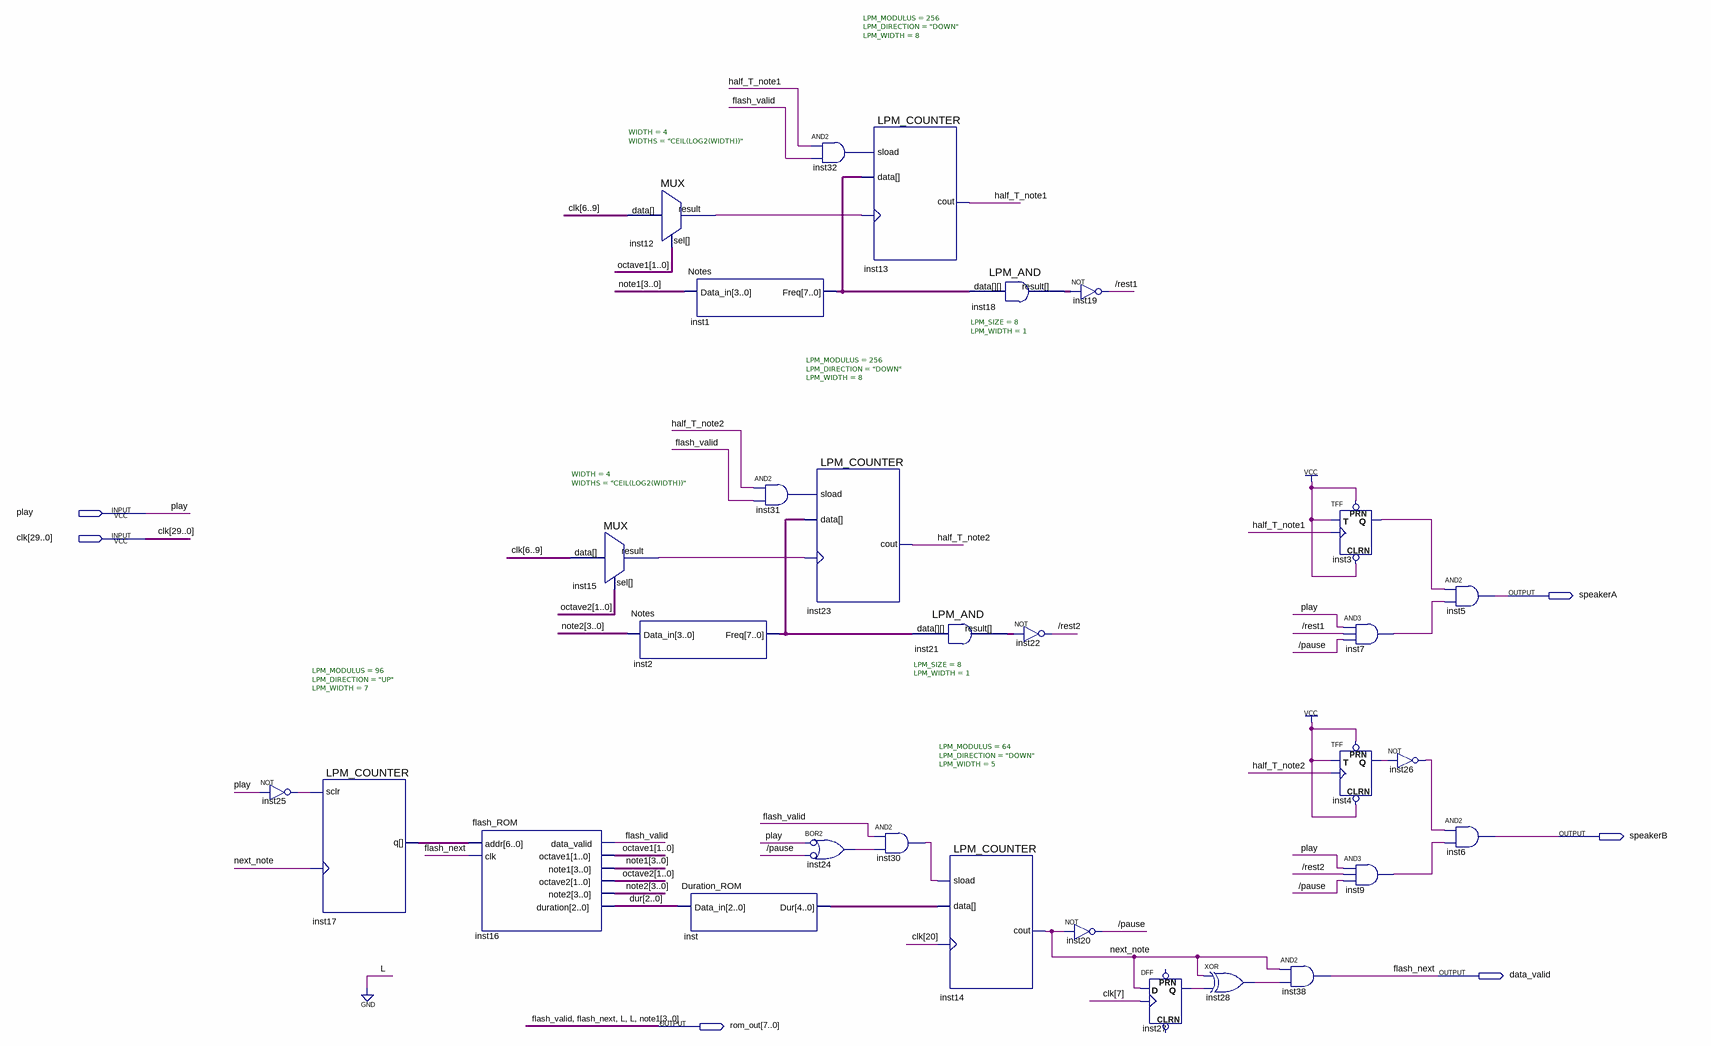
[diagram p0: schematic sheet]
// Quartus schematic Music_Player.bdf as structural Verilog: 30 symbols, 6 pins
module Music_Player (
  input  play,
  input  [29:0] clk,
  output speakerA,
  output speakerB,
  output data_valid,
  output [7:0] rom_out
);

  wire \/pause , \/rest1 , \/rest2 , half_T_note1, half_T_note2, inst3_q, inst4_q, inst7_out, inst9_out,
       inst12_result, inst15_result, inst18_result, inst21_result, inst24_out, inst25_out, inst26_out,
       inst27_q, inst28_out, inst30_out, inst31_out, inst32_out, next_note;
  wire [1:0] octave1, octave2;
  wire [2:0] dur;
  wire [3:0] note2;
  wire [4:0] inst_dur;
  wire [6:0] inst17_q;
  wire [7:0] inst1_freq, inst2_freq;

  not inst25 (inst25_out, play);
  LPM_COUNTER #(.LPM_MODULUS(96), .LPM_DIRECTION("UP"), .LPM_WIDTH(7)) inst17 (
    .clock(next_note), .sclr(inst25_out), .q(inst17_q));
  flash_ROM inst16 (
    .addr(inst17_q), .clk(data_valid), .data_valid(rom_out[7]), .octave1(octave1), .note1(rom_out[3:0]),
    .octave2(octave2), .note2(note2), .duration(dur));
  MUX #(.WIDTH(4), .WIDTHS("CEIL(LOG2(WIDTH))")) inst15 (
    .data({clk[6], clk[7], clk[8], clk[9]}), .sel(octave2), .result(inst15_result));
  MUX #(.WIDTH(4), .WIDTHS("CEIL(LOG2(WIDTH))")) inst12 (
    .data({clk[6], clk[7], clk[8], clk[9]}), .sel(octave1), .result(inst12_result));
  Notes inst2 (.Data_in(note2), .Freq(inst2_freq));
  Notes inst1 (.Data_in(rom_out[3:0]), .Freq(inst1_freq));
  Duration_ROM inst (.Data_in(dur), .Dur(inst_dur));
  and inst31 (inst31_out, half_T_note2, rom_out[7]);
  and inst32 (inst32_out, half_T_note1, rom_out[7]);
  LPM_COUNTER #(.LPM_MODULUS(256), .LPM_DIRECTION("DOWN"), .LPM_WIDTH(8)) inst23 (
    .clock(inst15_result), .data(inst2_freq), .sload(inst31_out), .cout(half_T_note2));
  or inst24 (inst24_out, ~play, ~\/pause );  // BOR2
  LPM_COUNTER #(.LPM_MODULUS(256), .LPM_DIRECTION("DOWN"), .LPM_WIDTH(8)) inst13 (
    .clock(inst12_result), .data(inst1_freq), .sload(inst32_out), .cout(half_T_note1));
  and inst30 (inst30_out, rom_out[7], inst24_out);
  LPM_AND #(.LPM_SIZE(8), .LPM_WIDTH(1)) inst21 (.data(inst2_freq), .result(inst21_result));
  LPM_COUNTER #(.LPM_MODULUS(64), .LPM_DIRECTION("DOWN"), .LPM_WIDTH(5)) inst14 (
    .clock(clk[20]), .data(inst_dur), .sload(inst30_out), .cout(next_note));
  LPM_AND #(.LPM_SIZE(8), .LPM_WIDTH(1)) inst18 (.data(inst1_freq), .result(inst18_result));
  not inst22 (\/rest2 , inst21_result);
  not inst19 (\/rest1 , inst18_result);
  not inst20 (\/pause , next_note);
  DFF inst27 (.CLK(clk[7]), .D(next_note), .Q(inst27_q));  // open: CLRN, PRN
  xor inst28 (inst28_out, next_note, inst27_q);
  and inst38 (data_valid, next_note, inst28_out);
  TFF inst3 (.PRN(1'b1), .CLRN(1'b1), .T(1'b1), .CLK(half_T_note1), .Q(inst3_q));
  and inst7 (inst7_out, play, \/rest1 , \/pause );
  TFF inst4 (.PRN(1'b1), .CLRN(1'b1), .T(1'b1), .CLK(half_T_note2), .Q(inst4_q));
  and inst9 (inst9_out, play, \/rest2 , \/pause );
  not inst26 (inst26_out, inst4_q);
  and inst5 (speakerA, inst3_q, inst7_out);
  and inst6 (speakerB, inst26_out, inst9_out);

  assign rom_out[6:4] = {data_valid, 2'b00};

  // Other names for the same wires on the sheet: flash_next = data_valid; flash_valid = rom_out[7];
  //   note1[3:0] = rom_out[3:0]
endmodule
